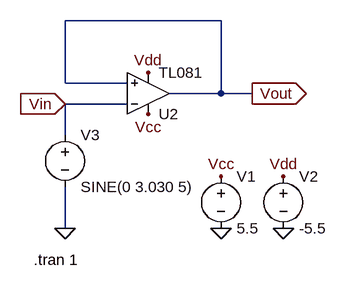
[diagram p0: schematic spaeningsforsyning.asc]
spaeningsforsyning.asc, the LTspice schematic file:
Version 4
SHEET 1 1000 680
WIRE 144 112 -96 112
WIRE -96 208 -96 112
WIRE 0 208 -96 208
WIRE 144 224 144 112
WIRE 144 224 64 224
WIRE 192 224 144 224
WIRE 0 240 -96 240
WIRE -96 288 -96 240
WIRE -96 432 -96 368
FLAG 144 352 Vcc
FLAG 32 192 Vdd
FLAG 32 256 Vcc
FLAG -96 432 0
FLAG 192 224 Vout
IOPIN 192 224 Out
FLAG 240 352 Vdd
FLAG 144 432 0
FLAG 240 432 0
FLAG -96 240 Vin
IOPIN -96 240 In
SYMBOL voltage 144 336 R0
SYMATTR InstName V1
SYMATTR Value 5.5
SYMBOL voltage 240 336 R0
SYMATTR InstName V2
SYMATTR Value -5.5
SYMBOL voltage -96 272 R0
SYMATTR InstName V3
SYMATTR Value SINE(0 3.030 5)
SYMBOL Opamps\\TL081 32 288 M180
SYMATTR InstName U2
TEXT -144 480 Left 2 !.tran 1

The netlist it stands for:
* spaeningsforsyning.asc
V1 Vcc 0 5.5
V2 Vdd 0 -5.5
V3 Vin 0 SINE(0 3.030 5)
XU2 Vout Vin Vcc Vdd Vout TL081  ; pins In+ In- V+ V- OUT
.tran 1
.backanno
.end